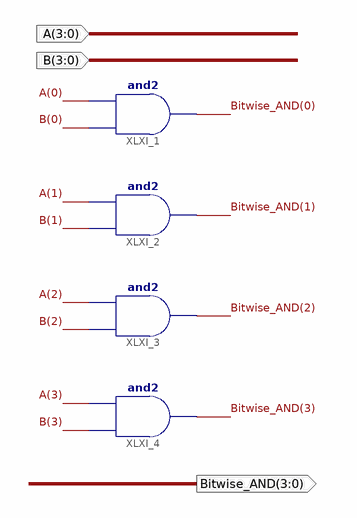
[diagram p0: schematic sheet 1]
// Xilinx ISE schematic Bitwise_AND.sch (artix7) as structural Verilog: 4 symbols, 3 ports
module Bitwise_AND (
  input  [3:0] A,
  input  [3:0] B,
  output [3:0] Bitwise_AND
);

  and XLXI_1 (Bitwise_AND[0], B[0], A[0]);
  and XLXI_2 (Bitwise_AND[1], B[1], A[1]);
  and XLXI_3 (Bitwise_AND[2], B[2], A[2]);
  and XLXI_4 (Bitwise_AND[3], B[3], A[3]);
endmodule
